# Altium project edp_falltrack.PrjPcb
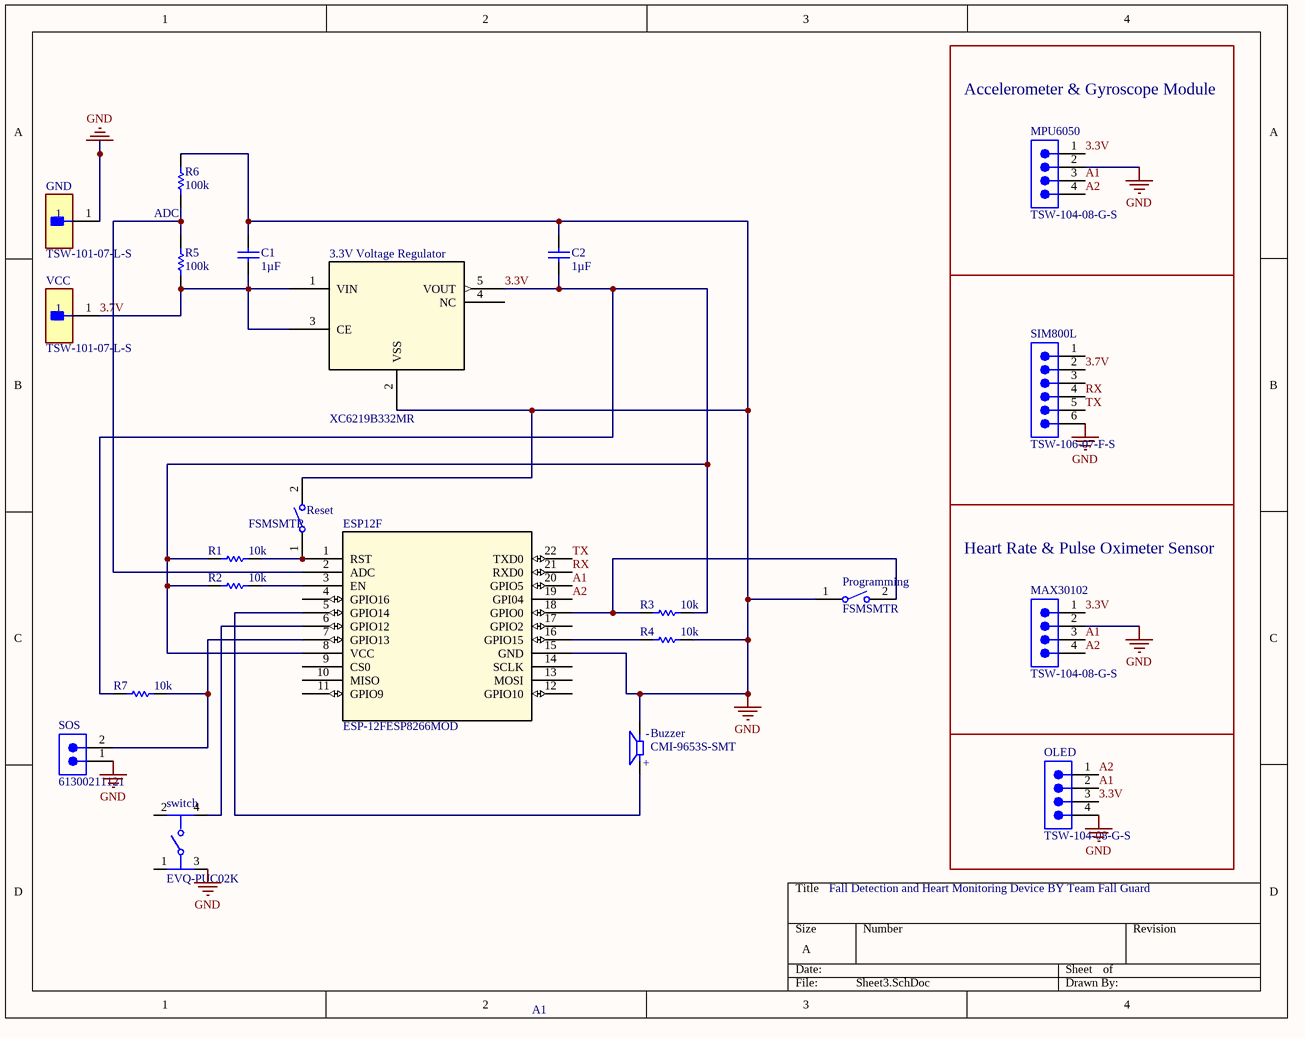
[diagram p0: Sheet3.SchDoc]
1 sheet, 22 parts. Net scope: global (net labels, ports and power ports of the same name join across sheets).
Board files: PCB1.PcbDoc, PCB3.PcbDoc, PCB4.PcbDoc, PCB52.PcbDoc

## Sheet Sheet3.SchDoc
size A; SheetNumber: 1; SheetTotal: 1

### Parts
3.3V_Voltage_Regulator  XC6219B332MR  [SOT-25_TOR]
Buzzer  CMI-9653S-SMT  [CUI_CMI-9653S-SMT]
C1  1µF  [CAPC1608X90X35LL10T15]
C2  1µF  [CAPC1608X90X35LL10T15]
ESP12F  ESP-12FESP8266MOD  [ESP-12FESP8266MOD_AIT]
GND  TSW-101-07-L-S  [FP-TSW-101-07-L-S-MFG]
MAX30102  TSW-104-08-G-S  [SMTC-TSW-104-08-X-S]
MPU6050  TSW-104-08-G-S  [SMTC-TSW-104-08-X-S]
OLED  TSW-104-08-G-S  [SMTC-TSW-104-08-X-S]
Programming  FSMSMTR  [TECO-FSMSMTR_V]
R1  10k  [RESC1609X50X30NL8T20]
R2  10k  [RESC1609X50X30NL8T20]
R3  10k  [RESC1609X50X30NL8T20]
R4  10k  [RESC1609X50X30NL8T20]
R5  100k  [RESC1609X50X30NL8T20]
R6  100k  [RESC1609X50X30NL8T20]
R7  10k  [RESC1609X50X30NL8T20]
Reset  FSMSMTR  [TECO-FSMSMTR_V]
SIM800L  TSW-106-07-F-S  [SMTC-TSW-106-07-X-S]
SOS  61300211121  [61300211121]
switch  EVQ-PUC02K  [FP-EVQ-PUC02K-MFG]
VCC  TSW-101-07-L-S  [FP-TSW-101-07-L-S-MFG]

### Nets
GND: 3.3V_Voltage_Regulator.2(VSS) Buzzer.N C1.2 C2.2 ESP12F.15(GND) GND.1 MAX30102.2 MPU6050.2 OLED.4 Programming.1 R4.2 R6.2 Reset.2 SIM800L.6 SOS.1 switch.3
3.3V: 3.3V_Voltage_Regulator.5(VOUT) C2.1 ESP12F.8(VCC) MAX30102.1 MPU6050.1 OLED.3 R1.1 R2.1 R3.2 R7.1
3.7V: 3.3V_Voltage_Regulator.1(VIN) 3.3V_Voltage_Regulator.3(CE) C1.1 R5.2 SIM800L.2 VCC.1
A1: ESP12F.20(GPIO5) MAX30102.3 MPU6050.3 OLED.2
A2: ESP12F.19(GPI04) MAX30102.4 MPU6050.4 OLED.1
RX: ESP12F.21(RXD0) SIM800L.4
TX: ESP12F.22(TXD0) SIM800L.5
NetBuzzer_P: Buzzer.P ESP12F.5(GPIO14)
NetESP12F_1: ESP12F.1(RST) R1.2 Reset.1
NetESP12F_2: ESP12F.2(ADC) R5.1 R6.1
NetESP12F_3: ESP12F.3(EN) R2.2
NetESP12F_6: ESP12F.6(GPIO12) switch.4
NetESP12F_7: ESP12F.7(GPIO13) R7.2 SOS.2
NetESP12F_16: ESP12F.16(GPIO15) R4.1
NetESP12F_18: ESP12F.18(GPIO0) Programming.2 R3.1

Not connected (* = marked no-connect by the designer): 3.3V_Voltage_Regulator 4(NC); ESP12F 4(GPIO16) 9(CS0) 10(MISO) 11(GPIO9) 12(GPIO10) 13(MOSI) 14(SCLK) 17(GPIO2); SIM800L 1 3; switch 1 2

### Notes on the sheet
- Accelerometer & Gyroscope Module
- (near R6) ADC
- Heart Rate & Pulse Oximeter Sensor
- Fall Detection and Heart Monitoring Device BY Team Fall Guard
- A1
- (in symbol CMI-9653S-SMT) -; +

### Library data of the parts
3.3V_Voltage_Regulator = XC6219B332MR: No Description Available; Mfr_Name: Torex Semiconductor; RefDes: RefDes; Type: Type
Buzzer = CMI-9653S-SMT: 9.6 mm, 3 Vdc, 80 dB, 2.7 kHz, Surface Mount (SMT), Driving Circuit, Magnetic Audio Indicator Buzzer; MF: Same Sky; MP: CMI-9653S-SMT-TR; SnapEDA_Link: https://www.snapeda.com/parts/CMI-9653S-SMT-TR/Same+Sky/view-part/?ref=snap; Package: None; Value: *; Check_prices: https://www.snapeda.com/parts/CMI-9653S-SMT-TR/Same+Sky/view-part/?ref=eda
C1 C2 = CMP-2000-06336-1: Chip Capacitor, 1 uF, +/- 10%, 10 V, -55 to 85 degC, 0603 (1608 Metric), RoHS, Tape and Reel; Manufacturer: Murata; Dielectric: X5R; Voltage Rating: 10V; Case Height: 0.8mm; Temperature Coefficient / Code: +/-15%; Type: GeneralPurposeMLCC; Brand: MurataElectronics; Capacitance: 1uF; Case Length: 1.6mm; Capacitance - nF: 1000nF; Package Description: 2-Pin Surface Mount Device, Body 1.6 x 0.8 mm; Maximum Operating Temperature: +85C; Minimum Operating Temperature: -55C; Mounting Technology: SurfaceMount; RoHS: Details; Package Reference: 0603; Product: GeneralTypeMLCCs; Packaging: Reel; Case Code - mm: 1608; Manufacturer URL: http://www.murata.com/; Dimensions: 0.8mmWx1.6mmLx0.8mmH; Factory Pack Quantity: 4000; Case Code - in: 0603; Tolerance: 10%; Product Category: MultilayerCeramicCapacitorsMLCC-SMD/SMT; Series: GRM; Datasheet Version: 02/2016; Case Width: 0.8mm; Operating Temperature Range: -55Cto+85C; Datasheet URL: http://search.murata.co.jp/Ceramy/image/img/A01X/G101/ENG/GRM188R61A105KA61-01.pdf; Package / Case: 0603(1608metric); Termination Style: SMD/SMT; Voltage Rating DC: 10V
ESP12F = ESP-12FESP8266MOD: No Description Available; Mfr_Name: Ai-Thinker; RefDes: RefDes; Type: Type
GND VCC = CMP-02766-001775-1: CONN HEADER VERT 1POS; Gender: Male; Number of Contacts: 1; Max Current Rating: 7.6A; Max Voltage Rating (AC): 550V; RoHS Compliant: Yes; Contact Finish - Mating: GOLD; Length: 2.54mm; Series: TSW; Insulation Material: PBT; Reach SVHC Compliant: Yes; Radiation Hardening: No; Contact Plating: Gold; Termination: Solder; Contact Type: Male Pin; Orientation: Straight; Number of Rows: 1; Depth: 2.54mm; Housing Material: Polyester; Lead Free: Lead Free; Fastening Type: Pull; Flammability Rating: UL94 V-0; Mount: Through Hole; Housing Color: Black; Contact Shape: Square; Min Operating Temperature: -55°C; Connector Type: Header; Contact Mating Length: 0.23inch; Width: 2.54mm; Packaging: Bulk; Contact Material: Bronze; Max Operating Temperature: 125°C; Number of Positions: 1; Color: Black; Insulation Color: Black
MAX30102 MPU6050 OLED = CMP-1024-00357-1: 0.025" SQ Post Header, Through-hole, Vertical, -55 to 125 degC, 2.54 mm Pitch, 4-Pin, Male, RoHS; Manufacturer: Samtec; Pitch: 2.54 mm; RoHS: True; ComponentLink3URL: http://www.samtec.com/documents/webfiles/cpdf/TSW-XXX-XX-XXX-X-XX-XXX-MKT.pdf; Mounting Technology: Through-hole; ComponentLink2URL: http://www.samtec.com/documents/webfiles/pdf/TSW_TH.PDF; ComponentLink1URL: http://www.samtec.com; ComponentLink3Description: Package Specification; PackageVersion: DM, 8/1988; ComponentLink2Description: Datasheet; PackageReference: TSW-104-08-X-S; PackageDescription: .025[0.64] SQ. Post Terminal Strip Assembly; PartNumber: TSW-104-08-G-S; ComponentLink1Description: Manufacturer URL; Temperature Range: -55 to 125 degC; DatasheetVersion: F-214; Orientation: Vertical
Programming Reset = CMP-2000-07501-1: FSMSM Push Button Switch, 50 mA, -35 to 85 degC, 2-Pin SMD, RoHS, Tape and Reel; Manufacturer: TE Connectivity; Voltage Rating (DC): 24V; Electrical Life: 20000Cycles; Operating Force: 180gf; Switch Travel: 0.25mm; Contact Current Rating: 50mA; Case\/Package: SMD/SMT; Actuator Length: 1.07mm; Throw Configuration: SPST; Actuator Material: Polyamide; Contact Resistance: 100mOhm; Illumination Type: Illuminated; Max Voltage Rating (DC): 12V; Manufacturer URL: http://www.te.com/; Lead Free: LeadFree; Packaging: TapeandReel; Min Operating Temperature: -35degC; Mechanical Life: 20000Cycles; Mount: SurfaceMount; REACH SVHC: Unknown; Package Quantity: 1800; Package Reference: FSMSMTR; RoHSCompliant: true; Max Operating Temperature: 85degC; Orientation: Straight; ELV: Compliant; Datasheet URL: http://www.te.com/commerce/DocumentDelivery/DDEController?Action=showdoc&DocId=Customer+Drawing%7F1437566-3%7FC2%7Fpdf%7FEnglish%7FENG_CD_1437566-3_C2_1437566_3_1_c.dwg.pdf%7F1437566-4; Package Description: 2-Pin Surface Mount Device, Body 6 x 3.5 mm, Pitch 9.19 mm; Current Rating: 50mA; Contact Plating: Silver; Termination: GullWing; Datasheet Version: Rev. C2, 08/2014; Contact Material: Brass; Mounting Technology: SurfaceMount
R1-R7 = CMP-1666-00005-4: Chip Resistor, 10 KOhm, +/- 1%, 100 mW, -55 to 155 degC, 0603 (1608 Metric), RoHS, Tape and Reel; Manufacturer: Vishay Semiconductor; Voltage Rating: 75 V; Max Operating Temperature: 155 degC; PackageDescription: 2-Pin Surface Mount Device, Body 1.575 x 0.85 mm; ComponentLink1Description: Manufacturer URL; RoHSCompliant: true; PackageReference: 0603; REACH SVHC: Unknown; Length: 1.55 mm; DatasheetVersion: 06/2012; Packaging: Tape and Reel; Min Operating Temperature: -55 degC; Mounting Technology: Surface Mount; ComponentLink2URL: https://datasheet.ciiva.com/11809/0900766b80d98afc-11809037.pdf; Height: 0.45 mm; ComponentLink2Description: Datasheet; Package Quantity: 5000; ComponentLink1URL: http://www.vishay.com/
SIM800L = CMP-1024-00385-1: 0.025" SQ Post Header, Through-hole, Vertical, -55 to 125 degC, 2.54 mm Pitch, 6-Pin, Male, RoHS; Manufacturer: Samtec; Pitch: 2.54 mm; Orientation: Vertical; RoHS: True; ComponentLink3Description: Package Specification; PartNumber: TSW-106-07-F-S; Temperature Range: -55 to 125 degC; PackageVersion: DM, 8/1988; ComponentLink2URL: http://www.samtec.com/documents/webfiles/pdf/TSW_TH.PDF; ComponentLink1Description: Manufacturer URL; ComponentLink2Description: Datasheet; ComponentLink1URL: http://www.samtec.com; DatasheetVersion: F-214; PackageReference: TSW-106-07-X-S; PackageDescription: .025[0.64] SQ. Post Terminal Strip Assembly; ComponentLink3URL: http://www.samtec.com/documents/webfiles/cpdf/TSW-XXX-XX-XXX-X-XX-XXX-MKT.pdf; Mounting Technology: Through-hole
SOS = CMP-1712-00002-6: NexarPartId: 20081794; Number of Contacts: 2; Pitch: 2.54mm; Connector Type: Male Pin; Voltage Rating: 250V; Current Rating: 3A; Gender: Male; Contact Resistance: 20mΩ; Height: 8.94mm; Lead Free: Lead Free; Number of Pins: 2; Termination: Through Hole; RoHS: Compliant; Lead Pitch: 2.54mm; REACH SVHC: No SVHC; Housing Material: PBT; Contact Mating Length: 5.9944mm; Min Operating Temperature: -40°C; Orientation: Vertical; Contact Material: Copper; Contact Gender: Male; Max Operating Temperature: 125°C; Number of Rows: 1; Number of Positions: 2; Packaging: Bulk; Contact Plating: Gold; Mount: Through Hole; Color: Black; Operating Supply Voltage: 250V
switch = CMP-05618-000046-1: SWITCH TACTILE SPST-NO 0.05A 12V; Current Rating: 50mA; Operating Force: 2.2N; Actuator Color: Black; Mechanical Life: 100000Cycles; Switch Function: Off-Mom; Switch Travel: 0.3mm; Throw Configuration: SPST; Contact Resistance: 500mR; Illumination Type: Non-Illuminated; Actuator Length: 1mm; Mount: Surface Mount; Contact Plating: Silver; Series: EVQPU; Packaging: Tape and Reel; Height: 1.65mm; Radiation Hardening: No; Termination: Gull Wing; Depth: 4.5mm; Max Operating Temperature: 70°C; RoHS Compliant: Yes; Contact Current Rating: 50mA; Length: 6.4mm; Electrical Life: 100000Cycles; Max Voltage Rating (DC): 12V; Package Quantity: 1; Width: 3.5mm; Min Operating Temperature: -40°C; Max Current Rating: 50mA; Orientation: Straight; Voltage Rating (DC): 12V; Size: 3.5mm; Lead Free: Lead Free